# EAGLE design logicBlocks-OR (EAGLE 6.2)
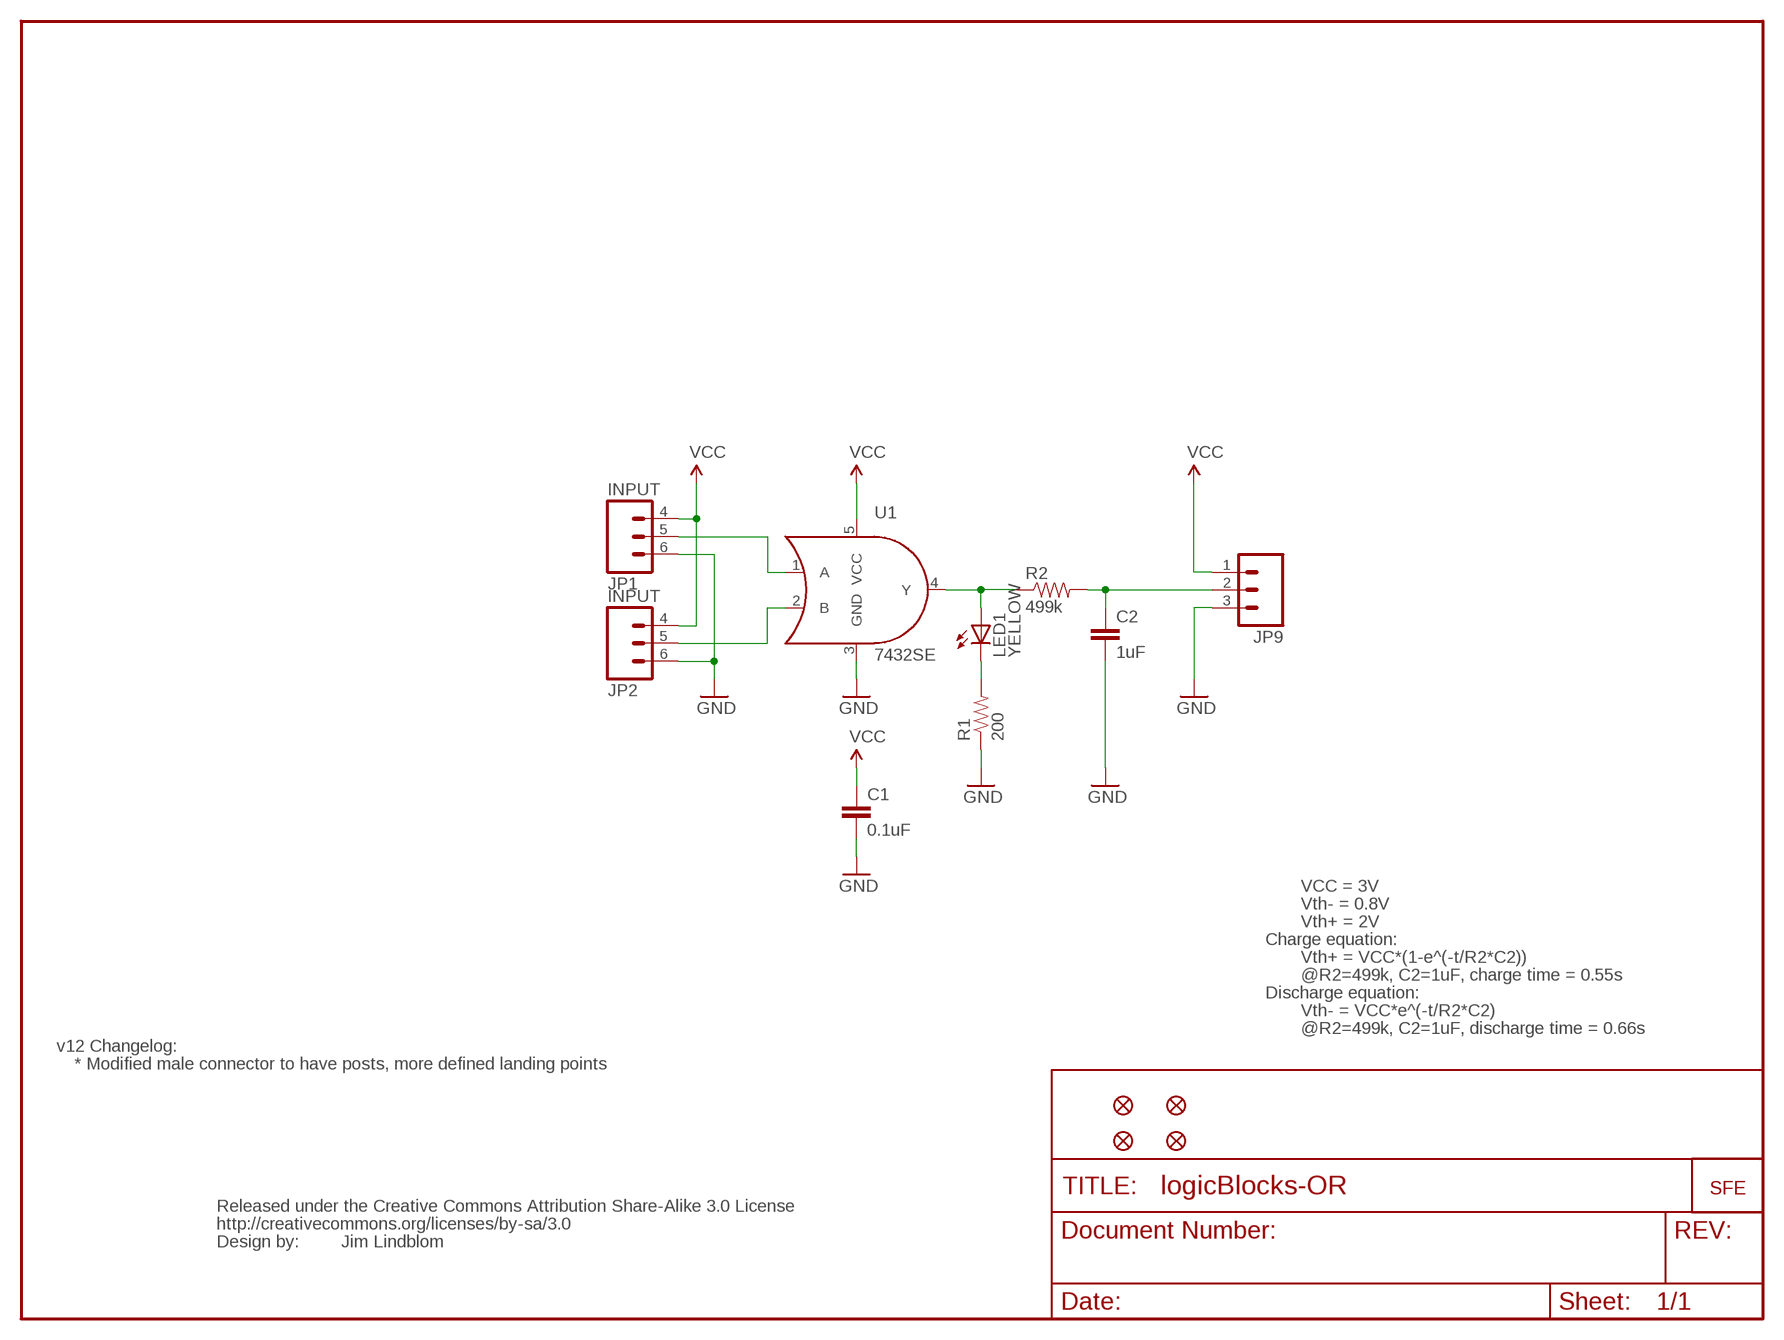
[diagram p0: schematic, sheet 1]

## Parts
C1  0.1uF  CAP0402-CAP  [0402-CAP]
C2  1uF  CAP0402-CAP  [0402-CAP]
JP1  INPUT  M03SMD-RA-FEMALE  [1X03-SMD-FEMALE]
JP2  INPUT  M03SMD-RA-FEMALE  [1X03-SMD-FEMALE]
JP4  LOGO-SFESK  [SFE-LOGO-FLAME]
JP5  FIDUCIALUFIDUCIAL  [MICRO-FIDUCIAL]
JP6  FIDUCIALUFIDUCIAL  [MICRO-FIDUCIAL]
JP7  FIDUCIALUFIDUCIAL  [MICRO-FIDUCIAL]
JP8  FIDUCIALUFIDUCIAL  [MICRO-FIDUCIAL]
JP9  M03SMD_RA_MALE_POST  [1X03_SMD_RA_MALE_POST]
LED1  YELLOW  LED1206  [LED-1206]
R1  200  RESISTOR0402-RES  [0402-RES]
R2  499k  RESISTOR0402-RES  [0402-RES]
U1  7432SE  [SOT353]
U$2  CREATIVE_COMMONS  [CREATIVE_COMMONS]

## Nets
GND: C1.2 C2.2 JP1.6 JP2.6 JP9.3 R1.1 U1.3(GND)
N$1: LED1.C R1.2
N$2: JP1.5 U1.1(A)
N$3: JP2.5 U1.2(B)
N$4: LED1.A R2.1 U1.4(Y)
N$5: C2.1 JP9.2 R2.2
VCC: C1.1 JP1.4 JP2.4 JP9.1 U1.5(VCC)

## Notes on the sheet
- VCC = 3V
- Vth- = 0.8V
- Vth+ = 2V
- Charge equation:
- Vth+ = VCC*(1-e^(-t/R2*C2))
- @R2=499k, C2=1uF, charge time = 0.55s
- Discharge equation:
- Vth- = VCC*e^(-t/R2*C2)
- @R2=499k, C2=1uF, discharge time = 0.66s
- v12 Changelog:
- * Modified male connector to have posts, more defined landing points
- Jim Lindblom

## Library data of the parts
C1 C2 = SparkFun:CAP: Capacitor Standard 0603 ceramic capacitor, and 0.1" leaded capacitor.
JP1 JP2 = SparkFun:M03: Header 3 Standard 3-pin 0.1" header. Use with straight break away headers (SKU : PRT-00116), right angle break away headers (PRT-00553), swiss pins (PRT-00743), machine pins (PRT-00117), and female headers (PRT-00115). Molex polarized connector foot print use with SKU : PRT-08232 with associated crimp pins and housings.
JP4 = SparkFun:LOGO-SFE: Spark Fun Electronics PCB Logo This is the standard Spark Fun Electronics PCB logo.
JP5-JP8 = SparkFun:FIDUCIAL: Fiducial Alignment Points Various fiducial points for machine vision alignment.
JP9 = SparkFun-Connectors:M03: Header 3 Standard 3-pin 0.1" header. Use with straight break away headers (SKU : PRT-00116), right angle break away headers (PRT-00553), swiss pins (PRT-00743), machine pins (PRT-00117), and female headers (PRT-00115). Molex polarized connector foot print use with SKU : PRT-08232 with associated crimp pins and housings.
LED1 = SparkFun:LED: LEDs Standard schematic elements and footprints for 5mm, 3mm, 1206, and 0603 sized LEDs. 5mm - Spark Fun Electronics SKU : COM-00529 (and others)
R1 R2 = SparkFun:RESISTOR: Resistor Basic schematic elements and footprints for 0603, 1206, and PTH resistors.
U1 = SparkFun:74*32: Single 2-input OR gate
U$2 = SparkFun:CREATIVE_COMMONS

## Board
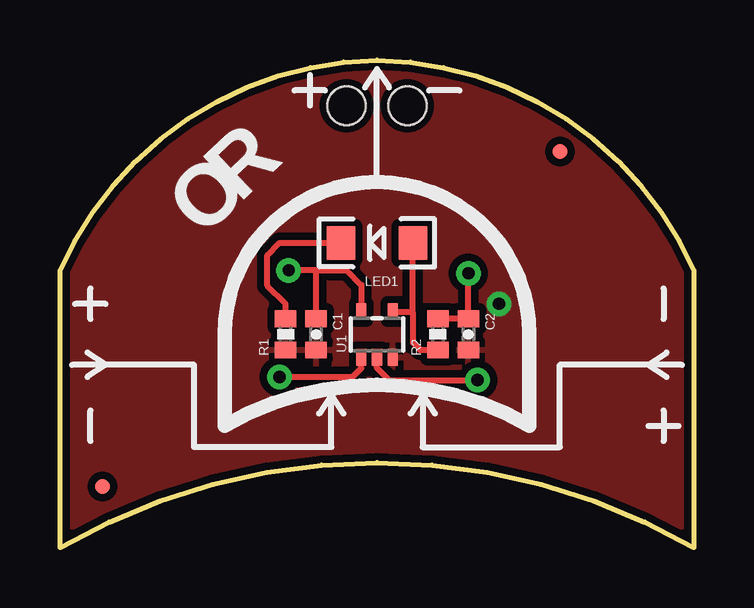
[diagram p1: board, top side]
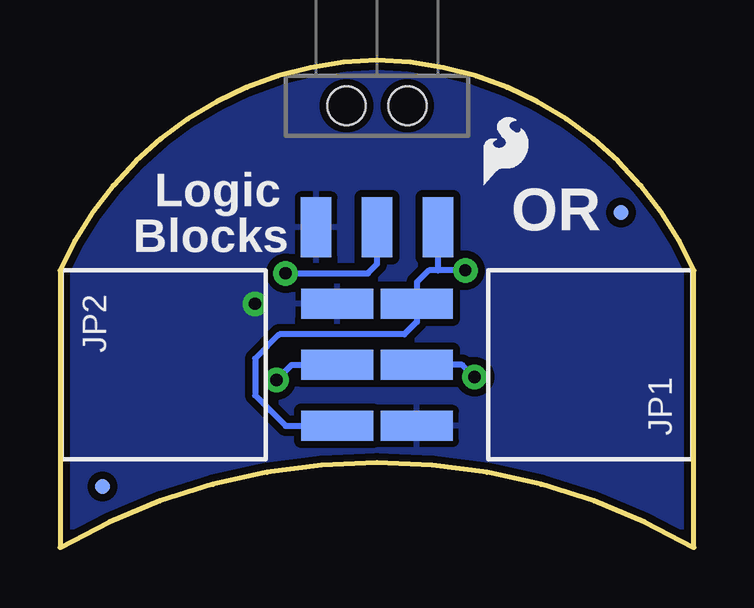
[diagram p2: board, bottom side, seen from below]

Size 26.42 x 20.32 mm. Coordinates in mm from the lower left corner, seen from the top.
Outline: 0,0 arc-60 26.42,0 26.42,11.56 arc65 13.21,20.32 arc65 0,11.56 0,0
Copper layers (1*16): Top 0.035mm / dielectric 1.5mm / Bottom 0.035mm
Design rules: minimum track width 8mil, minimum drill 20mil, track to track 8mil, track to pad 8mil, pad to pad 8mil, via to via 8mil, smd to smd 8mil, copper to edge 8mil, drill to drill 8mil, minimum pad ring 12mil, minimum via ring 10mil, stop-mask expansion 4mil, vias tented up to drill 20mil, thermal gap 10mil

### Footprints (pad centres in the part's own frame; a part is rotated, then mirrored left to right if it is on the bottom)
0402-CAP = smd 0.7 x 0.9: 1 -0.65,0; 2 0.65,0
1X03-SMD-FEMALE = smd 1.25 x 3: 4 2.54,7.225; 5 0,7.225; 6 -2.54,7.225
MICRO-FIDUCIAL = smd 0.635 x 0.635: 1 0,0
1X03_SMD_RA_MALE_POST = smd 1.27 x 2.5: 1 -2.54,5.07; 2 0,5.07; 3 2.54,5.07 | hole 1.6: -1.27,0; 1.27,0
LED-1206 = smd 1.2 x 1.4: A -1.5,0; C 1.5,0
0402-RES = smd 0.7 x 0.9: 1 -0.65,0; 2 0.65,0
SOT353 = smd 0.42 x 0.7: 1 -0.65,-0.95; 2 0,-0.95; 3 0.65,-0.95; 4 0.65,0.95; 5 -0.65,0.95

### Placement (x,y rotation side)
C1  10.67,8.89 270 top
C2  17.02,8.89 270 top
JP1  4.32,7.62 90 bottom
JP2  22.1,7.62 270 bottom
JP4  8.76,15.11 0 bottom
JP5  24.64,2.54 0 bottom
JP6  3.05,13.97 0 bottom
JP7  20.83,16.51 0 top
JP8  1.78,2.54 0 top
JP9  13.21,18.41 180 bottom
LED1  13.21,12.7 180 top
R1  9.4,8.89 90 top
R2  15.75,8.89 90 top
U1  13.21,8.89 0 top
U$2  0.51,-3.81 0 top  (outside the outline)

### Tracks (layer width: path | path; a pad name or v marks a point on that pad's centre or on a via)
GND  (via drill 0.51)
  other vias: 18.29,10.16
  pour Top (isolate 0.305): 0,0 0,11.56 arc-65 13.21,20.32 arc-65 26.42,11.56 26.42,0 arc60
  pour Bottom (isolate 0.305): 0,0 0,11.56 arc-65 13.21,20.32 arc-65 26.42,11.56 26.42,0 arc60
N$1
  Top 0.254: R1.2 9.4,10.16 8.64,10.92 8.64,12.19 9.14,12.7 LED1.C
N$2  (via drill 0.51)
  Top 0.254: v9.14,7.11 12.19,7.11 12.56,7.48 U1.1
  Bottom 0.254: JP1.5 9.65,7.62 v9.14,7.11
N$3  (via drill 0.51)
  Top 0.254: U1.2 13.21,7.49 13.72,6.99 v17.4,6.99
  Bottom 0.254: v17.4,6.99 16.76,7.62 JP2.5
N$4
  Top 0.254: R2.1 15,8.24 14.71,8.53 14.71,9.78 | 14.71,9.78 LED1.A | U1.4 14.65,9.84 14.71,9.78
N$5  (via drill 0.51)
  Top 0.254: R2.2 C2.1 v17.02,11.43
  Bottom 0.254: v17.02,11.43 13.59,11.43 13.21,11.81 JP9.2
VCC  (via drill 0.51)
  Top 0.254: U1.5 12.56,10.94 11.94,11.56 10.67,11.56 | 10.67,11.56 v9.52,11.56 | C1.1 10.67,11.56
  Bottom 0.254: v9.52,11.56 10.67,11.56 | JP2.4 17.02,5.08 18.29,6.35 18.29,7.87 17.27,8.89 12.07,8.89 11.54,9.41 JP1.4 11.54,11.06 11.05,11.56 10.67,11.56 | JP9.1 10.67,11.56

### Text on the board
tPlace: R | O
bPlace: Logic | OR | Blocks